# EAGLE design FinalSch (EAGLE 9.0.1)
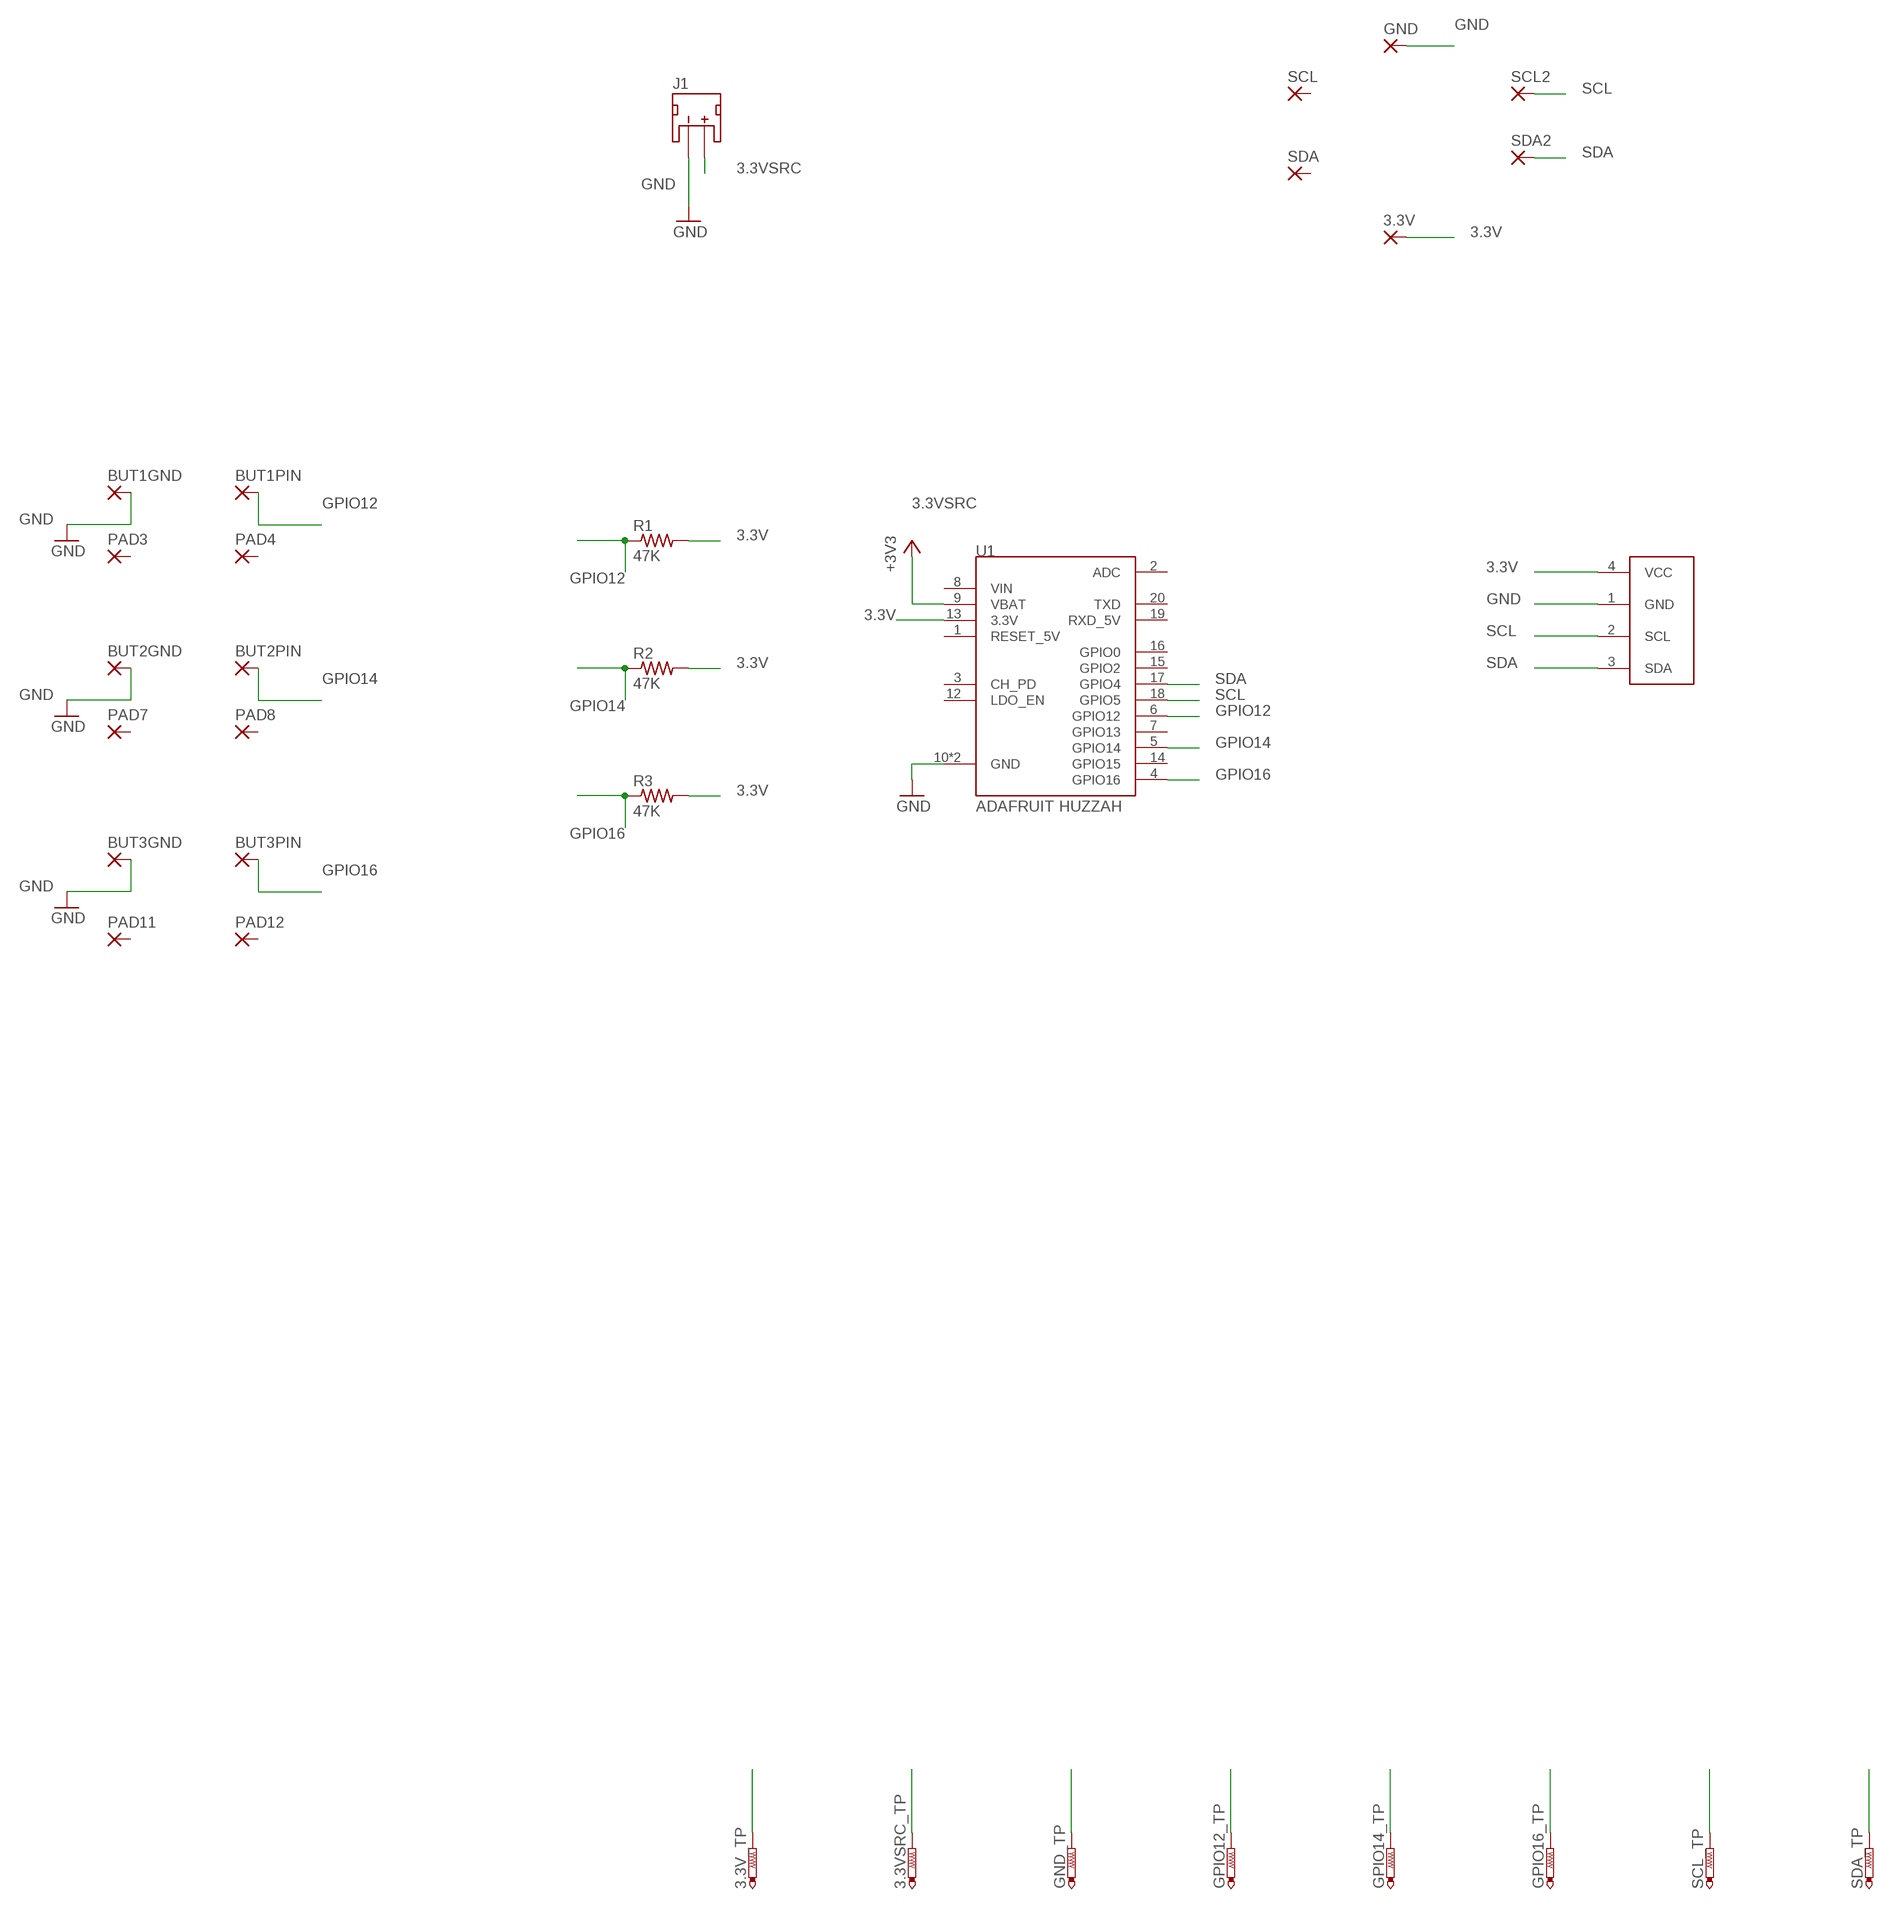
[diagram p0: schematic, sheet 1]

## Parts
3.3V  2,54/1,1  [2,54/1,1]
3.3V_TP  PTR1B1,27  [B1,27]
3.3VSRC_TP  PTR1B1,27  [B1,27]
BUT1GND  SMD2  [SMD1,27-2,54]
BUT1PIN  SMD2  [SMD1,27-2,54]
BUT2GND  SMD2  [SMD1,27-2,54]
BUT2PIN  SMD2  [SMD1,27-2,54]
BUT3GND  SMD2  [SMD1,27-2,54]
BUT3PIN  SMD2  [SMD1,27-2,54]
GND  2,54/1,1  [2,54/1,1]
GND_TP  PTR1B1,27  [B1,27]
GPIO12_TP  PTR1B1,27  [B1,27]
GPIO14_TP  PTR1B1,27  [B1,27]
GPIO16_TP  PTR1B1,27  [B1,27]
J1  JST_2MM_MALE  [JST-2-SMD]
PAD3  SMD2  [SMD1,27-2,54]
PAD4  SMD2  [SMD1,27-2,54]
PAD7  SMD2  [SMD1,27-2,54]
PAD8  SMD2  [SMD1,27-2,54]
PAD11  SMD2  [SMD1,27-2,54]
PAD12  SMD2  [SMD1,27-2,54]
R1  47K  R47K-0805  [R0805]
R2  47K  R47K-0805  [R0805]
R3  47K  R47K-0805  [R0805]
SCL  2,54/1,1  [2,54/1,1]
SCL2  2,54/1,1  [2,54/1,1]
SCL_TP  PTR1B1,27  [B1,27]
SDA  2,54/1,1  [2,54/1,1]
SDA2  2,54/1,1  [2,54/1,1]
SDA_TP  PTR1B1,27  [B1,27]
U1  ADAFRUIT_HEZZAH  [ADAFRUIT_HUZZAH]
U$1  I2C_OLED  [I2C_OLED_PACKAGE]

## Nets
3.3V: 3.3V.1(P) 3.3V_TP.TP R1.2 R2.2 R3.2 U1.13(3.3V) U$1.4(VCC)
3.3VSRC: 3.3VSRC_TP.TP J1.2(+) U1.9(VBAT) ; supply symbol labelled +3V3
GND: BUT1GND.1(P) BUT2GND.1(P) BUT3GND.1(P) GND.1(P) GND_TP.TP J1.1(-) U1.10(GND) U1.11(GND) U$1.1(GND)
GPIO12: BUT1PIN.1(P) GPIO12_TP.TP R1.1 U1.6(GPIO12)
GPIO14: BUT2PIN.1(P) GPIO14_TP.TP R2.1 U1.5(GPIO14)
GPIO16: BUT3PIN.1(P) GPIO16_TP.TP R3.1 U1.4(GPIO16)
SCL: SCL2.1(P) SCL_TP.TP U1.18(GPIO5) U$1.2(SCL)
SDA: SDA2.1(P) SDA_TP.TP U1.17(GPIO4) U$1.3(SDA)
Unconnected: J1.NC1(PAD1) J1.NC2(PAD2) PAD3.1(P) PAD4.1(P) PAD7.1(P) PAD8.1(P) PAD11.1(P) PAD12.1(P) SCL.1(P) SDA.1(P) U1.1(RESET_5V) U1.2(ADC) U1.3(CH_PD) U1.7(GPIO13) U1.8(VIN) U1.12(LDO_EN) U1.14(GPIO15) U1.15(GPIO2) U1.16(GPIO0) U1.19(RXD_5V) U1.20(TXD)

## Library data of the parts
3.3V GND SCL SCL2 SDA SDA2 = wirepad:2,54/1,1: THROUGH-HOLE PAD
3.3V_TP 3.3VSRC_TP GND_TP GPIO12_TP GPIO14_TP GPIO16_TP SCL_TP SDA_TP = testpad:PTR1: TEST PIN
BUT1GND BUT1PIN BUT2GND BUT2PIN BUT3GND BUT3PIN PAD3 PAD4 PAD7 PAD8 PAD11 PAD12 = wirepad:SMD2: SMD PAD
J1 = SparkFun-Connectors:JST_2MM_MALE: JST 2MM MALE RA CONNECTOR Two pin, compact surface mount connector. Commonly used as a battery input connection point. We really like the solid locking feeling and high current rating on these small connectors. We use these all the time as battery connectors. Mates to single-cell LiPo batteries. Here is the connector we sell at SparkFun: JST Right Angle Connector - White <https://www.sparkfun.com/products/8612> (PRT-08612) Datasheet <http://www.sparkfun.com/datasheets/Prototyping/Connectors/JST-Horizontal.pdf> It was used on these SparkFun products: SparkFun MOSFET Power Controller <https://www.sparkfun.com/products/11214> (PRT-11214) SparkFun Battery Babysitter - LiPo Battery Manager <https://www.sparkfun.com/products/13777> (PRT-13777) And many, many others that required a lipo battery connection.; PROD_ID: CONN-11443; SF_ID: PRT-08612
R1-R3 = ME216M-LibararyWithESP:R47K-0805: 47k Ohm ±1% 0.125W, 1/8W Chip Resistor 0805
U1 = ME216M-LibararyWithESP:ADAFRUIT_HEZZAH: Through Hole header to connect an Adafruit Hezzah
U$1 = DIYMall_OLED:I2C_OLED

## Board
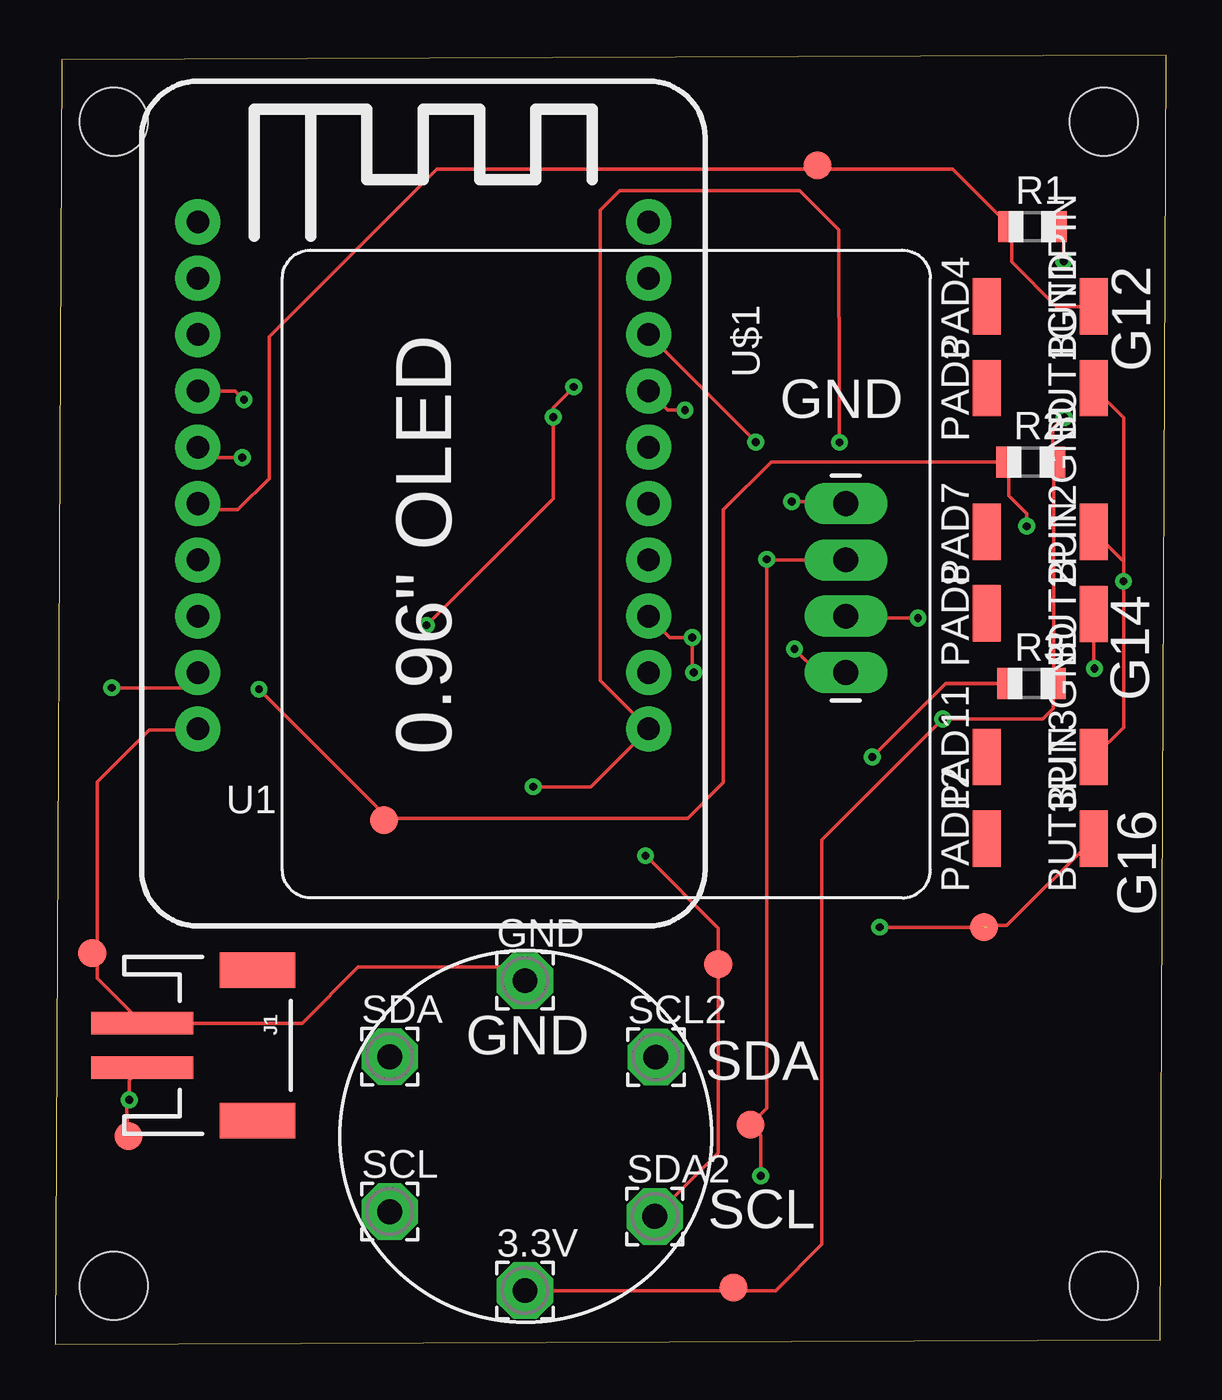
[diagram p1: board, top side]
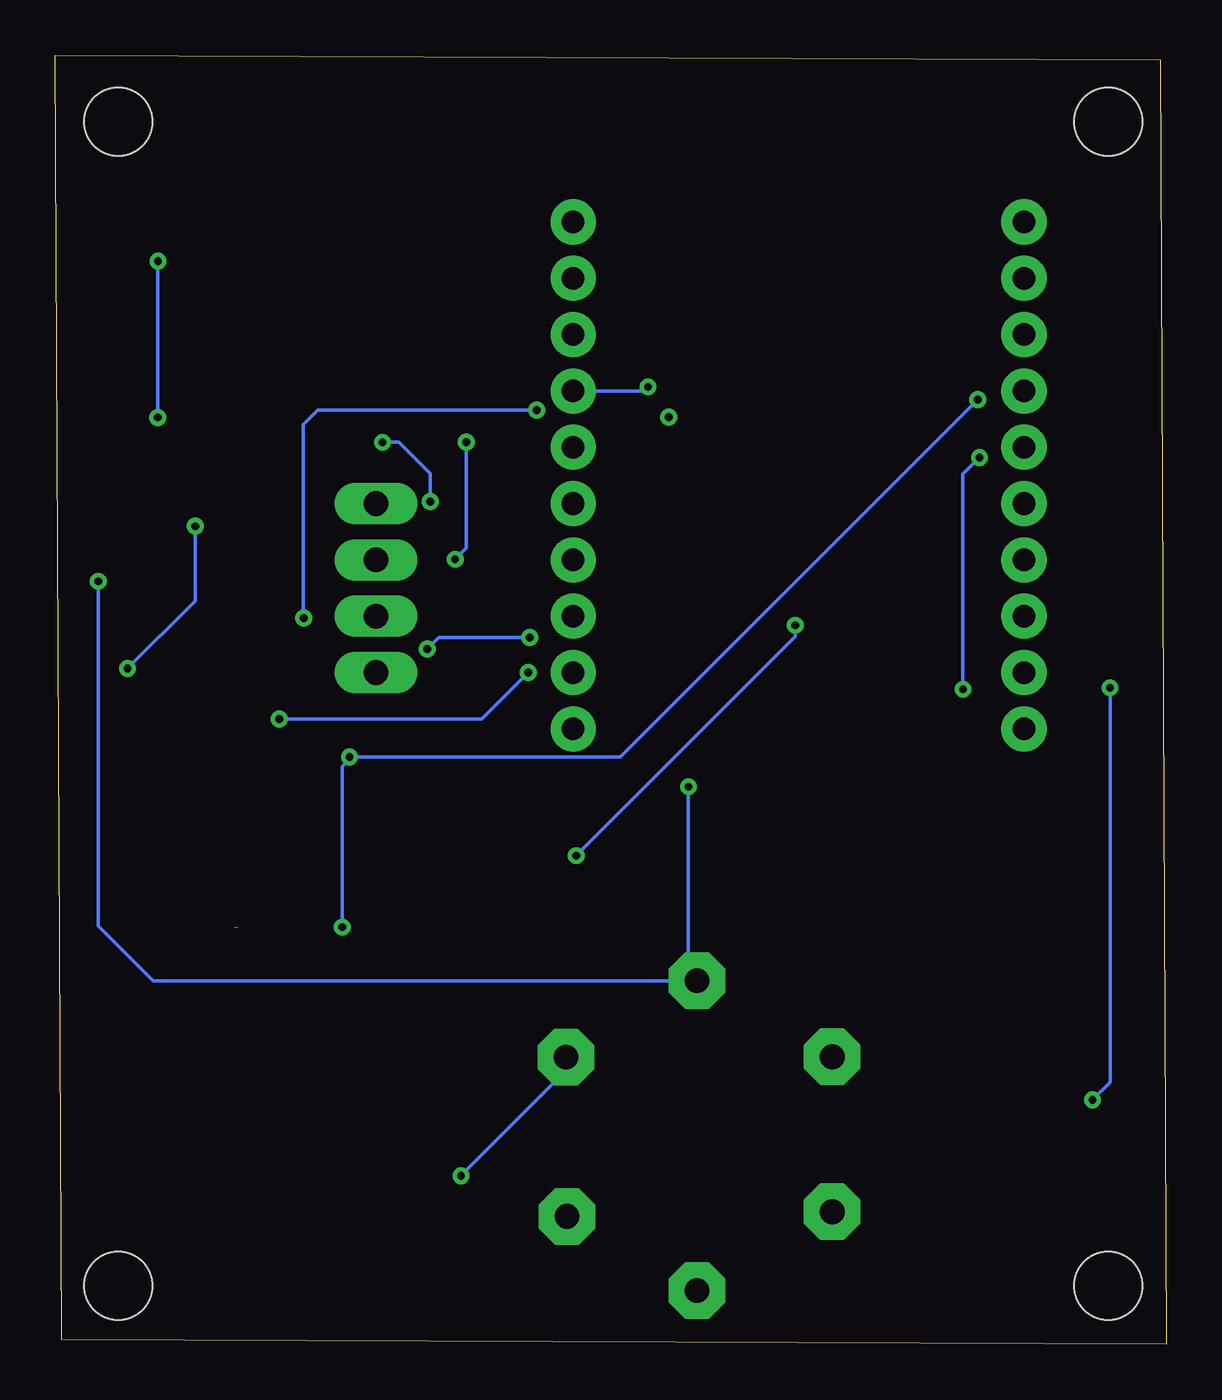
[diagram p2: board, bottom side, seen from below]

Size 50.08 x 58.11 mm. Coordinates in mm from the lower left corner, seen from the top.
Outline: 0,0 49.81,0.19 50.08,58.11 0.27,57.92 0,0
Copper layers (1*16): Top 0.035mm / dielectric 1.5mm / Bottom 0.035mm
Design rules "default": minimum track width 6mil, minimum drill 0.35mm, track to track 6mil, track to pad 6mil, pad to pad 6mil, via to via 6mil, smd to smd 6mil, copper to edge 40mil, drill to drill 6mil, minimum pad ring 10mil, minimum via ring 8mil, stop-mask expansion 4mil, vias tented up to drill 0mil, thermal gap 10mil
Holes 3.05 mm at 2.62,2.62 47.25,2.62 2.62,55.12 47.25,55.12

### Footprints (pad centres in the part's own frame; a part is rotated, then mirrored left to right if it is on the bottom)
2,54/1,1 = drill 1.118 pad 2.54 octagon: 1 0,0
B1,27 = smd 1.27 x 1.27: TP 0,0
SMD1,27-2,54 = smd 1.27 x 2.54: 1 0,0
JST-2-SMD = smd 1 x 4.6: 1 -1,-3.7; 2 1,-3.7 | smd 1.6 x 3.4: NC1 -3.4,1.5; NC2 3.4,1.5
R0805 = smd 1.1 x 1.4: 1 -1,0; 2 1,0
ADAFRUIT_HUZZAH = drill 1.016 pad 2.032: 1 2.54,31.75; 2 2.54,29.21; 3 2.54,26.67; 4 2.54,24.13; 5 2.54,21.59; 6 2.54,19.05; 7 2.54,16.51; 8 2.54,13.97; 9 2.54,11.43; 10 2.54,8.89; 11 22.86,8.89; 12 22.86,11.43; 13 22.86,13.97; 14 22.86,16.51; 15 22.86,19.05; 16 22.86,21.59; 17 22.86,24.13; 18 22.86,26.67; 19 22.86,29.21; 20 22.86,31.75
I2C_OLED_PACKAGE = drill 1.118 pad 1.88 long: 1 0,0; 2 2.54,0; 3 5.08,0; 4 7.62,0

### Placement (x,y rotation side)
3.3V  21.16,2.41 0 top
3.3V_TP  30.56,2.55 0 top
3.3VSRC_TP  3.29,9.38 0 top
BUT1GND  46.81,43.11 0 top
BUT1PIN  46.81,46.79 0 top
BUT2GND  46.81,36.63 0 top
BUT2PIN  46.81,32.92 0 top
BUT3GND  46.81,26.47 0 top
BUT3PIN  46.81,22.79 0 top
GND  21.16,16.38 0 top
GND_TP  1.66,17.63 0 top
GPIO12_TP  34.35,53.14 0 top
GPIO14_TP  14.81,23.62 0 top
GPIO16_TP  41.86,18.8 0 top
J1  7.61,13.47 270 top
PAD3  41.98,43.11 0 top
PAD4  41.98,46.79 0 top
PAD7  41.98,36.63 0 top
PAD8  41.98,32.95 0 top
PAD11  41.98,26.47 0 top
PAD12  41.98,22.79 0 top
R1  44.04,50.39 0 top
R2  43.96,39.77 0 top
R3  44,29.79 0 top
SCL  15.07,5.97 0 top
SCL2  27.06,12.94 0 top
SCL_TP  31.32,9.9 0 top
SDA  15.07,12.95 0 top
SDA2  27.02,5.75 0 top
SDA_TP  29.88,17.12 0 top
U1  3.88,18.85 0 top
U$1  35.63,37.9 270 top

### Tracks (layer width: path | path; a pad name or v marks a point on that pad's centre or on a via)
3.3V  (via drill 0.35)
  Top 0.152: U1.13 27.7,31.86 v28.7,31.86 28.7,30.35 v28.77,30.28 | v33.31,31.34 34.38,30.28 U$1.4 | 30.61,2.41 3.3V.1 21.01,2.32 | 30.61,2.41 32.46,2.41 34.55,4.5 34.55,22.74 v39.99,28.19 44.51,28.19 44.97,28.66 44.97,29.93 45,29.96 | R3.2 45,29.96 | 45,29.96 45,39.73 R2.2 44.96,41.27 v45.47,41.78 | R1.2 45.46,49.98 v45.46,48.83 | 3.3V_TP.TP 30.61,2.47 30.61,2.41
  Bottom 0.152: v28.7,31.86 32.8,31.86 v33.31,31.34 | v28.77,30.28 30.86,28.19 v39.99,28.19 | v45.46,48.83 45.46,41.8 v45.47,41.78
3.3VSRC  (via drill 0.35)
  Top 0.152: 3.89,12.45 J1.2 3.33,11.89 v3.33,11.01 3.18,11 3.3VSRC_TP.TP | v2.54,29.59 5.73,29.59 U1.9
  Bottom 0.152: v3.33,11.01 2.54,11.8 v2.54,29.59
GND  (via drill 0.35)
  Top 0.152: J1.1 1.9,16.48 1.9,17.71 | 1.9,17.71 1.9,25.35 4.24,27.69 6.37,27.69 U1.10 | v33.18,37.99 35.54,37.99 U$1.1 | J1.1 11.12,14.47 13.64,17 20.55,17 GND.1 | v21.54,25.13 24.13,25.13 U1.11 24.56,29.92 24.56,51.13 25.45,52.02 33.56,52.02 35.32,50.26 35.32,46.32 35.34,46.3 v35.34,40.66 | BUT2GND.1 48.15,35.29 | 48.15,35.29 v48.15,34.4 48.15,27.81 BUT3GND.1 | BUT1GND.1 48.15,41.77 48.15,35.29 | 3.79,14.51 J1.1 | 1.9,17.71 1.81,17.71 GND_TP.TP | 1.96,17.71 1.9,17.71
  Bottom 0.152: v21.54,25.13 21.54,16.76 GND.1 45.67,16.38 48.15,18.86 v48.15,34.4 | v35.34,40.66 34.59,40.66 33.18,39.25 v33.18,37.99
GPIO12
  Top 0.152: 34.18,52.98 40.45,52.98 R1.1 43.1,50.34 43.1,48.81 45.12,46.79 BUT1PIN.1 | 6.61,37.71 U1.6 | U1.6 6.69,37.63 8.23,37.63 9.63,39.04 9.63,45.43 17.19,52.98 33.19,52.98 34.18,52.98 | 6.69,37.52 6.69,37.67 U1.6 | 34.18,52.98 GPIO12_TP.TP
GPIO14  (via drill 0.35)
  Top 0.152: 14.91,23.8 14.99,23.71 28.5,23.71 30.11,25.32 30.11,37.63 32.26,39.77 R2.1 42.96,38.26 43.78,37.44 v43.78,36.88 | 14.91,23.8 v9.17,29.53 | v8.43,39.98 6.89,39.98 U1.5 | BUT2PIN.1 46.81,30.49 v46.83,30.46 | GPIO14_TP.TP 14.92,23.65 14.92,23.81 14.91,23.8
  Bottom 0.152: v9.17,29.53 9.17,39.23 v8.43,39.98 | v46.83,30.46 43.78,33.51 v43.78,36.88
GPIO16  (via drill 0.35)  (1 unrouted)
  Top 0.152: R3.1 40.13,29.79 v36.82,26.47 | v8.5,42.59 8.11,42.98 U1.4 | BUT3PIN.1 42.89,18.87 42.08,18.87 42,18.79 39.76,18.79 | 39.76,18.79 v37.15,18.79 37.17,18.78 | 39.76,18.78 39.76,18.79
  Bottom 0.152: v36.82,26.47 36.72,26.47 | 36.72,26.47 24.62,26.47 v8.5,42.59 | v37.15,18.79 37.15,26.04 36.72,26.47
SCL  (via drill 0.35)
  Top 0.152: U1.18 31.57,40.7 v31.57,40.68 | U$1.2 32.09,35.36 v32.06,35.39 32.06,10.64 SCL_TP.TP 31.8,9.42 v31.8,7.58
  Bottom 0.152: v31.57,40.68 31.57,35.89 v32.06,35.39 | v31.8,7.58 27.06,12.32 SCL2.1
  other vias: 27.06,12.94
SDA  (via drill 0.35)
  Top 0.152: U1.17 27.61,42.11 v28.38,42.11 | v38.89,32.74 35.71,32.74 U$1.3 | v16.72,32.41 22.44,38.12 v22.44,41.79 22.44,42.23 v23.37,43.16 | v26.6,22.03 29.88,18.75 SDA_TP.TP 29.88,8.61 SDA2.1
  Bottom 0.152: v28.38,42.11 38.26,42.11 38.92,41.45 38.92,32.77 v38.89,32.74 | v26.6,22.03 16.72,31.9 v16.72,32.41 | v23.37,43.16 23.55,42.98 U1.17

### Text on the board
tPlace: G12 | GND | G14 | G16 | GND | SDA | SCL